# Altium schematic sheet Portier.SchDoc: Montage OUT
size A4; Author: SCA; DrawnBy: IPE; Engineer: IPE; Address1: ETML-ES; Address2: Rue de Sébeillon 12; Address3: 1004 Lausanne; Revision: 17300B; SheetNumber: 2; SheetTotal: 3; Version: B
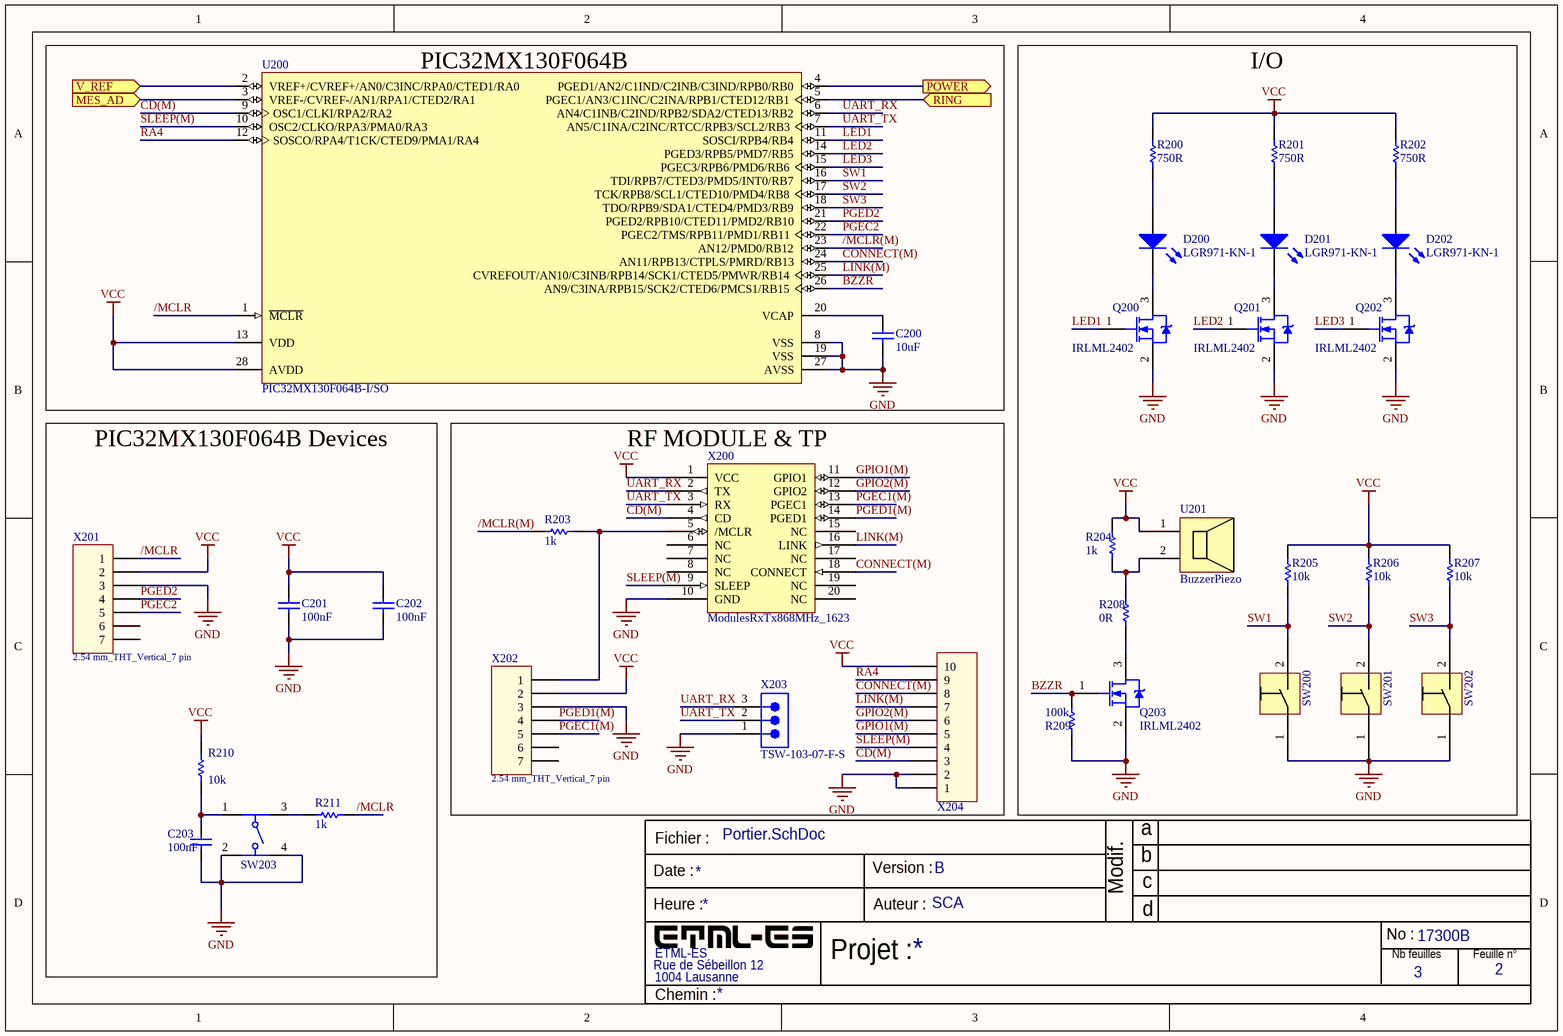
[diagram p0: Portier.SchDoc]

## Parts
C200  10uF  [CAPC3216X180X50ML20T25]
C201  100nF  [CAPC2013X100X20NL20]
C202  100nF  [CAPC2013X100X20NL20]
C203  100nF  [CAPC2013X100X20NL20]
D200  LGR971-KN-1  [LED_0805]
D201  LGR971-KN-1  [LED_0805]
D202  LGR971-KN-1  [LED_0805]
Q200  IRLML2402  [INTR-IRLML2402TRPBF-3_V]
Q201  IRLML2402  [INTR-IRLML2402TRPBF-3_V]
Q202  IRLML2402  [INTR-IRLML2402TRPBF-3_V]
Q203  IRLML2402  [INTR-IRLML2402TRPBF-3_V]
R200  750R  [RESC0805(2012)_N]
R201  750R  [RESC0805(2012)_N]
R202  750R  [RESC0805(2012)_N]
R203  1k  [RESC2013X60X35ML10T20]
R204  1k  [RESC2013X60X35ML10T20]
R205  10k  [RESC2013X60X35NL10T20]
R206  10k  [RESC2013X60X35NL10T20]
R207  10k  [RESC2013X60X35NL10T20]
R208  0R  [RESC2013X60X35ML10T20]
R209  100k  [RESC2013X60X35ML10T20]
R210  10k  [RESC2013X60X35NL10T20]
R211  1k  [RESC2013X60X35NL10T20]
SW200  SW  [Switch_Schurter]  (value not drawn)
SW201  SW  [Switch_Schurter]  (value not drawn)
SW202  SW  [Switch_Schurter]  (value not drawn)
SW203  430152050836  [4301x20508x6_6x6x5]  (value not drawn)
U200  PIC32MX130F064B-I/SO  [MCHP-SOIC-SO28_L]
U201  BuzzerPiezo  [Buzzer]
X200  ModulesRxTx868MHz_1623  [ModulesRxTx868MHz_1623]
X201  2.54 mm_THT_Vertical_7 pin  [61300711121]
X202  2.54 mm_THT_Vertical_7 pin  [61300711121]
X203  TSW-103-07-F-S  [SMTC-TSW-103-07-X-S]
X204  61301011121  [61301011121]  (value not drawn)

## Ports
MES_AD (in), POWER (out), RING (in), V_REF (in)

## Nets
GND: C200.2 C201.1 C202.1 C203.1 Q200.2(S) Q201.2(S) Q202.2(S) Q203.2(S) R209.1 SW200.1 SW201.1 SW202.1 SW203.2 SW203.4 U200.8(VSS) U200.19(VSS) U200.27(AVSS) X200.10(GND) X201.3 X202.3 X203.1 X204.1 X204.2
VCC: C201.2 C202.2 R200.1 R201.1 R202.2 R204.2 R205.2 R206.2 R207.2 R210.1 U200.13(VDD) U200.28(AVDD) U201.1 X200.1(VCC) X201.2 X202.2 X204.10
/MCLR: R211.2 U200.1(~{MCLR}) X201.1
/MCLR(M): R203.2 U200.23(AN12/PMD0/RB12)
BZZR: Q203.1(G) R209.2 U200.26(AN9/C3INA/RPB15/SCK2/CTED6/PMCS1/RB15)
CD(M): U200.9(OSC1/CLKI/RPA2/RA2) X200.4(CD) X204.3
CONNECT(M): U200.24(AN11/RPB13/CTPLS/PMRD/RB13) X200.18(CONNECT) X204.8
GPIO1(M): X200.11(GPIO1) X204.5
GPIO2(M): X200.12(GPIO2) X204.6
LED1: Q200.1(G) U200.11(SOSCI/RPB4/RB4)
LED2: Q201.1(G) U200.14(PGED3/RPB5/PMD7/RB5)
LED3: Q202.1(G) U200.15(PGEC3/RPB6/PMD6/RB6)
LINK(M): U200.25(CVREFOUT/AN10/C3INB/RPB14/SCK1/CTED5/PMWR/RB14) X200.16(LINK) X204.7
MES_AD: U200.3(VREF-/CVREF-/AN1/RPA1/CTED2/RA1) ; port MES_AD
PGEC1(M): X200.13(PGEC1) X202.5
PGEC2: U200.22(PGEC2/TMS/RPB11/PMD1/RB11) X201.5
PGED1(M): X200.14(PGED1) X202.4
PGED2: U200.21(PGED2/RPB10/CTED11/PMD2/RB10) X201.4
POWER: U200.4(PGED1/AN2/C1IND/C2INB/C3IND/RPB0/RB0) ; port POWER
RA4: U200.12(SOSCO/RPA4/T1CK/CTED9/PMA1/RA4) X204.9
RING: U200.5(PGEC1/AN3/C1INC/C2INA/RPB1/CTED12/RB1) ; port RING
SLEEP(M): U200.10(OSC2/CLKO/RPA3/PMA0/RA3) X200.9(SLEEP) X204.4
SW1: R205.1 SW200.2 U200.16(TDI/RPB7/CTED3/PMD5/INT0/RB7)
SW2: R206.1 SW201.2 U200.17(TCK/RPB8/SCL1/CTED10/PMD4/RB8)
SW3: R207.1 SW202.2 U200.18(TDO/RPB9/SDA1/CTED4/PMD3/RB9)
UART_RX: U200.6(AN4/C1INB/C2IND/RPB2/SDA2/CTED13/RB2) X200.2(TX) X203.3
UART_TX: U200.7(AN5/C1INA/C2INC/RTCC/RPB3/SCL2/RB3) X200.3(RX) X203.2
V_REF: U200.2(VREF+/CVREF+/AN0/C3INC/RPA0/CTED1/RA0) ; port V_REF
NetC200_1: C200.1 U200.20(VCAP)
NetC203_2: C203.2 R210.2 SW203.1
NetD200_1: D200.1(A) R200.2
NetD200_2: D200.2(K) Q200.3(D)
NetD201_1: D201.1(A) R201.2
NetD201_2: D201.2(K) Q201.3(D)
NetD202_1: D202.1(A) R202.1
NetD202_2: D202.2(K) Q202.3(D)
NetQ203_3: Q203.3(D) R208.1
NetR203_1: R203.1 X200.5(/MCLR) X202.1
NetR204_1: R204.1 R208.2 U201.2
NetR211_1: R211.1 SW203.3

Not connected (* = marked no-connect by the designer): X200 6(NC) 7(NC) 8(NC) 15(NC) 17(NC) 19(NC) 20(NC); X201 6 7; X202 6 7

## Notes on the sheet
- PIC32MX130F064B
- RF MODULE & TP
- I/O
- PIC32MX130F064B Devices
- Fichier :
- a
- Date :
- Heure :
- Version :
- Auteur :
- Modif.
- b
- c
- d
- Projet :
- No :
- Nb feuilles
- Feuille n°
- Chemin :

## Library data of the parts
C200 = CMP-1664-00006-1: CAP, Ceramic, 10 uF, +/- 10%, 16 V, -55 to 125 degC, 1206 (3216 Metric), RoHS, Tape and Reel; Voltage Rating: 50 V; PackageCase: 0603; Value: 10 uF; Supplier: Stock ES
C201-C203 = CMP-1663-00007-1: Chip Capacitor, 100 nF, +/- 10%, 16 V, -55 to 85 degC, 0805 (2012 Metric), RoHS, Tape and Reel; Voltage Rating: 16 V; PackageCase: 0805; Value: 100 nF; Supplier: Stock ES
D200-D202 = LGR971-KN-1: SMD mono-color Chip LED, 0805, Green; Manufacturer: OSRAM; PackageReference: 0805_A; Color: Green; PartNumber: LGR971-KN-1; ComponentLink1Description: Manufacturer URL; ComponentLink2Description: Datasheet; Supplier: Stock ES
Q200-Q203 = CMP-2000-05155-1: HEXFET(R) Power MOSFET, N-Channel, 20 V, 1.2 A, 3-Pin SOT-23, RoHS, Tape and Reel; Manufacturer: Infineon Technologies; PartNumber: IRLML2402TRBF; PackageCase: SOT-23; Supplier: Digi-key,Stock ES; Supplier PN: IRLML2402PBFCT-ND; Supplier min. qty: 1; Supplier unit price: 0.34
R200-R202 = CMP-1013-00496-1: 750R 0.125W 1% 0805 (2012 Metric)  SMD; Value: 750.00 Ohm; PackageCase: 0805; Supplier: Stock ES
R203 R204 R208 = CMP-2100-03671-1: Chip Resistor, 1 KOhm, +/- 1%, 125 mW, -55 to 155 degC, 0805 (2012 Metric), RoHS, Tape and Reel; Voltage Rating: 150V; Value: 1kOhm; PackageCase: 0805; Supplier: Stock ES
R205-R207 = CMP-1659-00013-4: Chip Resistor, 10 KOhm, +/- 1%, 0.125 W, -55 to 155 degC, 0805 (2012 Metric), RoHS, Tape and Reel; Voltage Rating: 150 V; PackageCase: 0805; Value: 10k; Supplier: Stock ES
R209 = CMP-2100-03671-1: Chip Resistor, 100 KOhm, +/- 1%, 125 mW, -55 to 155 degC, 0805 (2012 Metric), RoHS, Tape and Reel; Voltage Rating: 150V; PackageCase: 0805; Value: 100k; Supplier: Stock ES
R210 = CMP-1659-00011-4: Chip Resistor, 10 KOhm, +/- 1%, 0.125 W, -55 to 155 degC, 0805 (2012 Metric), RoHS, Tape and Reel; Voltage Rating: 150 V; PackageCase: 0805; Value: 10k; Supplier: Stock ES
R211 = CMP-1659-00011-4: Chip Resistor, 1 KOhm, +/- 1%, 0.125 W, -55 to 155 degC, 0805 (2012 Metric), RoHS, Tape and Reel; Voltage Rating: 150 V; PackageCase: 0805; Value: 1k; Supplier: Stock ES
SW200-SW202 = Switch_Schurter: Switch 12.7x12.7x17.5; Manufacturer: Schurter
SW203 = 430152050836: WS-TASV 6x6mm Tact Switch, SMD version; Operation Force: 360g; ComponentLink1Description: Manufacturer; ComponentLink1URL: http://www.we-online.de; ComponentLink2Description: Datasheet; ComponentLink2URL: http://katalog.we-online.de/em/datasheet/4301x2xxx8x6.pdf; Part Number: 430152050836; Published Date: June 2017; Publisher: Wurth Elektronik; Life Cycle: 200000 cycles; Size: 6x6x5 mm; Supplier: Stock ES
U200 = CMP-0048-00454-1: 32-bit Microcontroller with Audio and Graphics Interface, USB and Advanced Analog, 40 MHz, 21 I/O, PMP, -40 to 85 degC, 28-pin SOIC (SO28), Tube; Manufacturer: Microchip; ComponentLink4URL: http://www.microchip.com/PIC32MX130F064B; DatasheetVersion: Rev. E; ComponentLink1URL: http://www.microchip.com; ComponentLink2URL: http://ww1.microchip.com/downloads/en/DeviceDoc/61168E.pdf; PackageDescription: 28-Lead Plastic Small Outline, 17.9 x 7.5 mm Body, 1.27 mm Pitch; PackageVersion: C04-052C; Mounting Technology: Surface Mount; ComponentLink2Description: Datasheet; ComponentLink3URL: http://www.microchip.com/stellent/groups/techpub_sg/documents/packagingspec/en012702.pdf; PartNumber: PIC32MX130F064B-I/SO; PackageReference: SOIC-SO28; ComponentLink1Description: Manufacturer URL; ComponentLink3Description: Package Specification; ComponentLink4Description: Product URL; Supplier: Digi-key; Supplier PN: PIC32MX130F064B-I/SO-ND
U201 = BZR: Buzzer 12mm piezo; Manufacturer: TDK Corporation; PartNumber: PS1240P02BT; Supplier: Digi-key; Supplier PN: 445-2525-1-ND; Supplier min. qty: 1; Supplier unit price: 0.67
X200 = ModulesRxTx868MHz_1623: 2x Header 2x10 2mm / compatible xBee; PackageCase: XBee; Value: 2x10; Supplier: Digi-key; Supplier PN: 2x 3M156413-10-ND; Supplier min. qty: 1; Supplier unit price: 2x 0.74
X201 X202 = 61300711121: Pin Header WR-PHD, pitch 2.54 mm, THT, Vertical, single row, 7 pin; Rated Current: 3 A; Pin Number: 7; Pitch: 2.54 mm; Working Voltage: 250 VAC; Contact Resistance: 20 mOhm; Insulation Resistance: >1000 MOhm; ComponentLink1Description: Manufacturer; ComponentLink1URL: http://www.we-online.de; ComponentLink2Description: Datasheet; ComponentLink2URL: http://katalog.we-online.de/em/datasheet/6130xx11121.pdf; Part Number: 61300711121; Published Date: Jan. 2018; Publisher: Wurth Elektronik; Operating Temperature: -40 to 105 degC; Mounting Technology: THT; Row Number: Single; Orientation: Vertical; Supplier: Stock ES
X203 = CMP-1024-00331-1: 0.025" SQ Post Header, Through-hole, Vertical, -55 to 125 degC, 2.54 mm Pitch, 3-Pin, Male, RoHS; Value: 1x3; PackageCase: TSW-103-07-X-S; Supplier: Stock ES
X204 = 61301011121: WR-PHD 2.54 mm THT Pin Header, 10p; Pin Number: 10; Rated Current: 3 A; Working Voltage: 250 VAC; Withstanding Voltage: 500 VAC; Pitch: 2.54 mm; ComponentLink1Description: Manufacturer; ComponentLink1URL: http://www.we-online.de; ComponentLink2Description: Datasheet; ComponentLink2URL: http://katalog.we-online.de/em/datasheet/6130xx11121.pdf; Part Number: 61301011121; Published Date: Aug 2017; Publisher: Wurth Elektronik